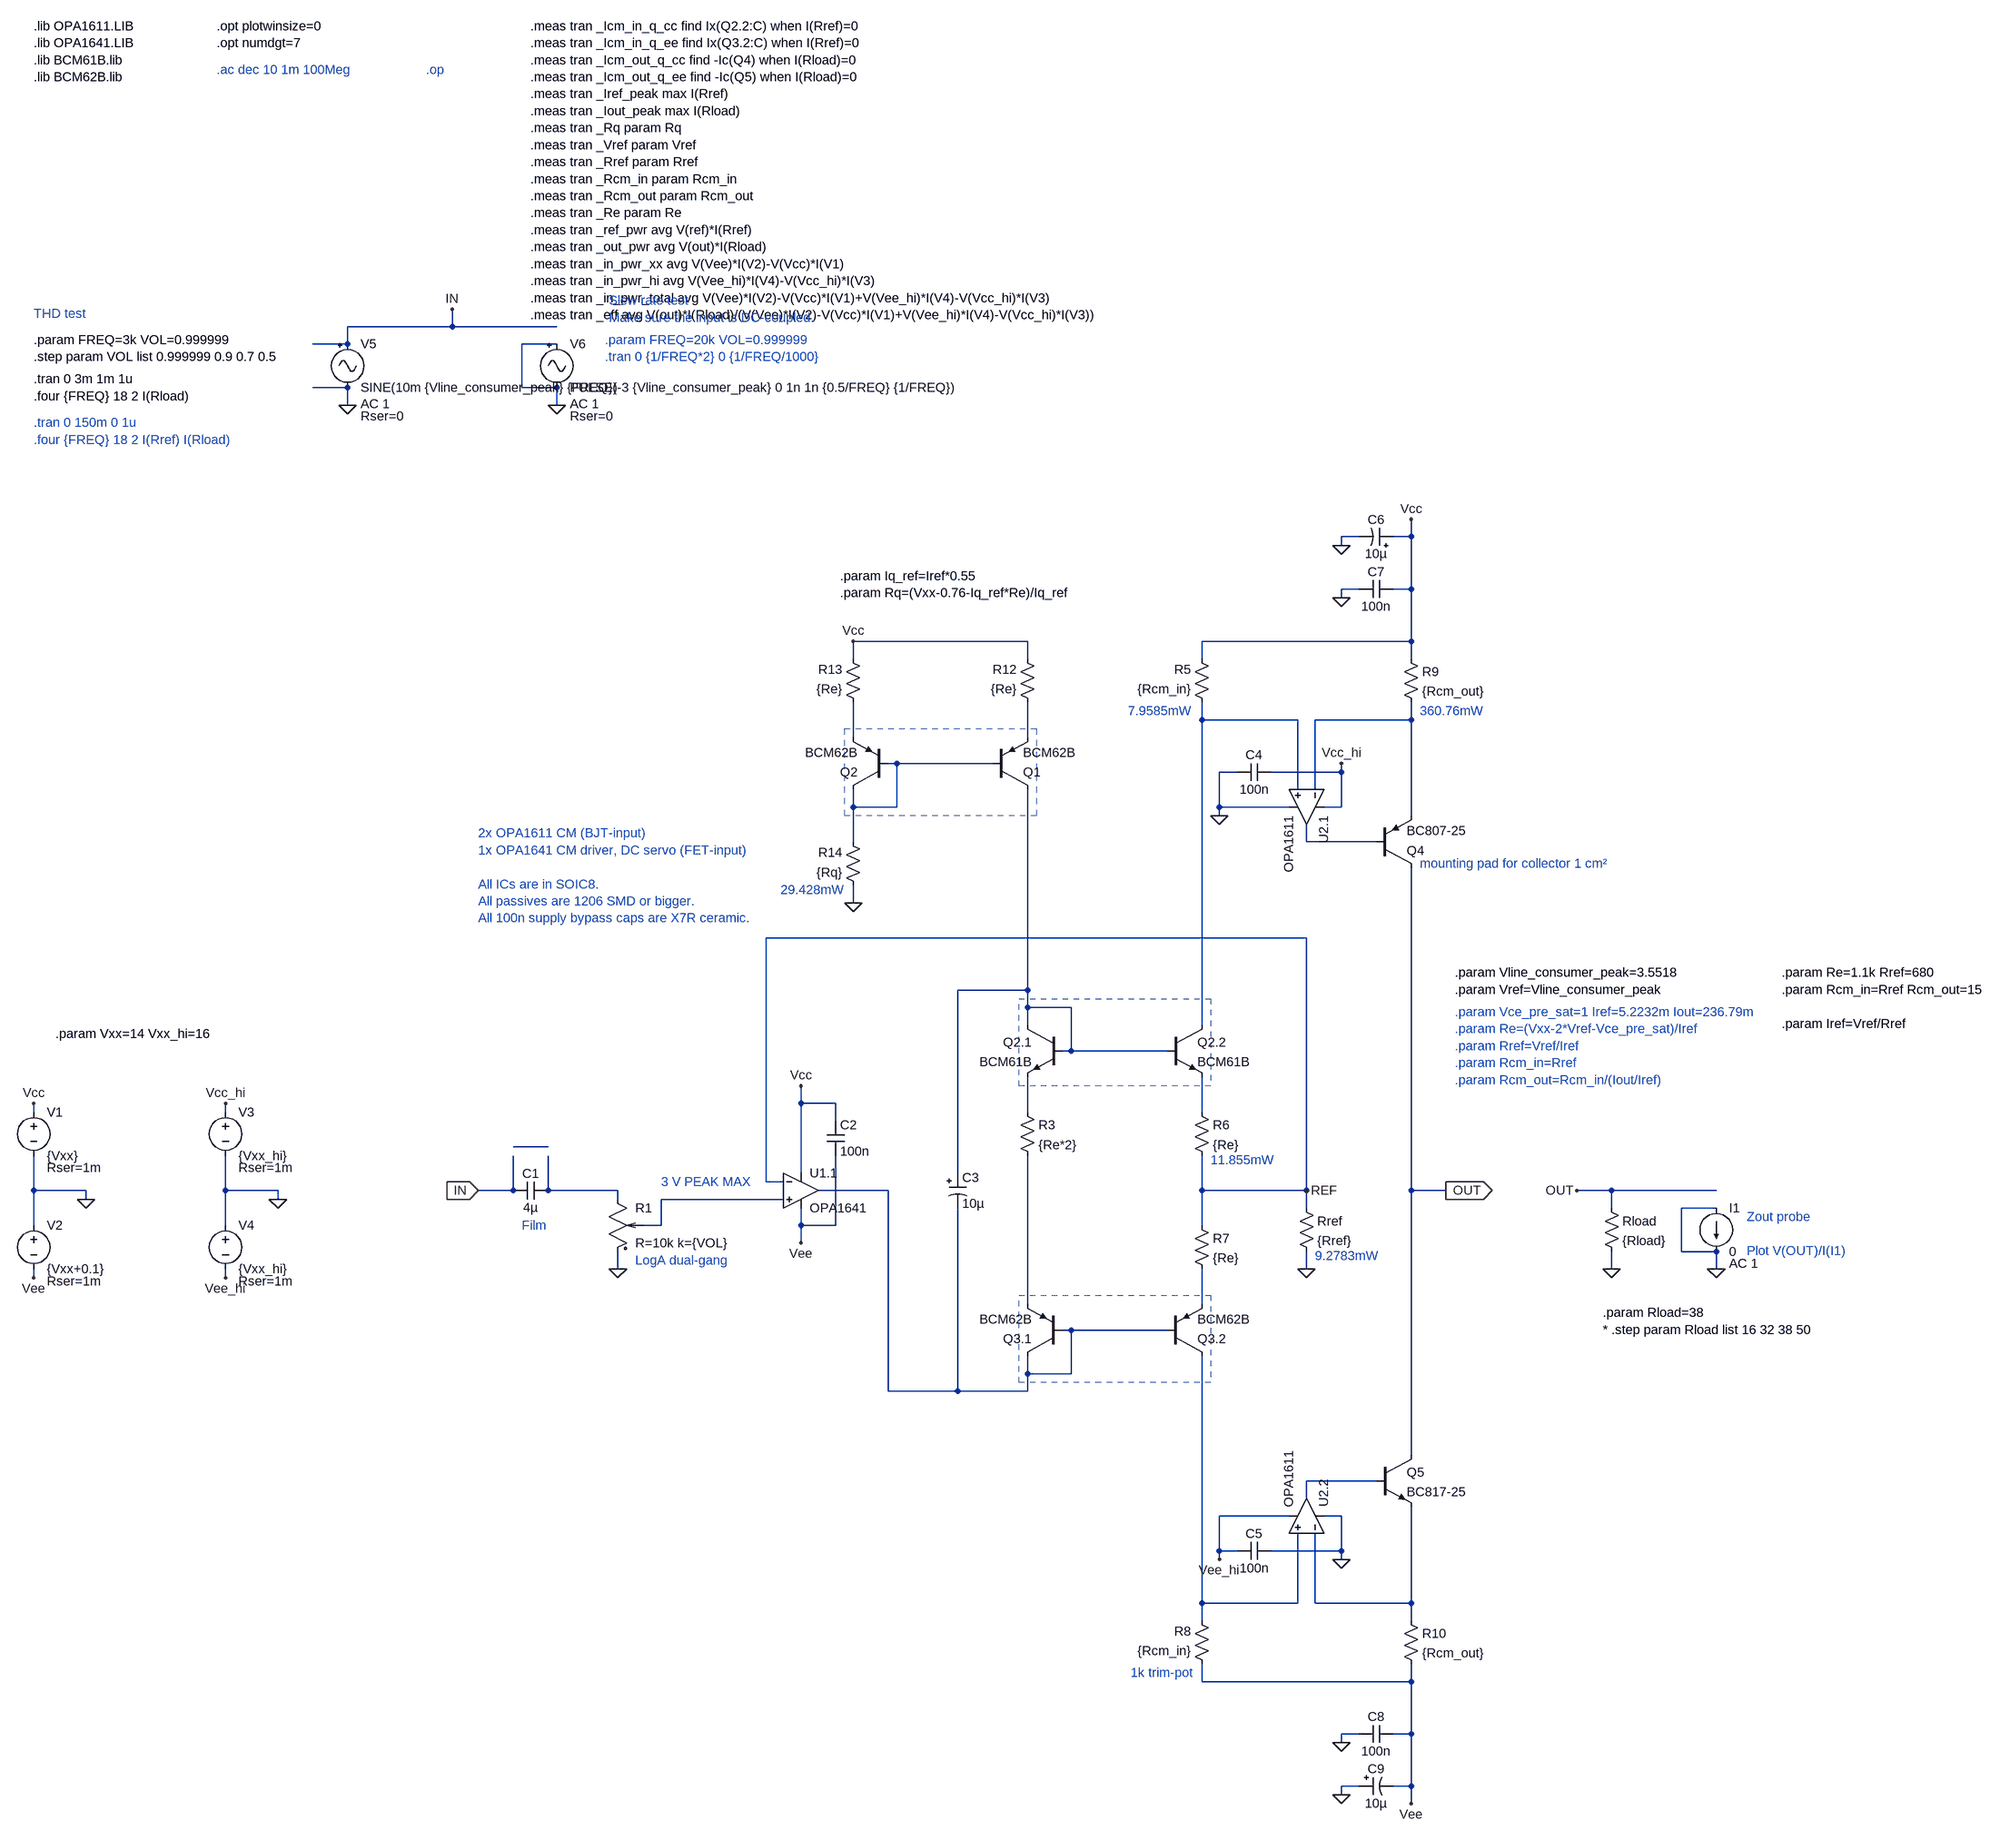
[diagram p0: schematic current-dr-amp.asc]
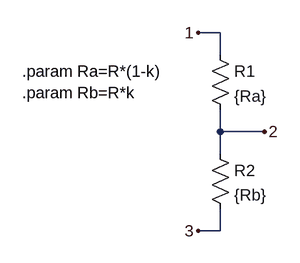
[diagram p1: sub-circuit pot_lin.asc]
current-dr-amp.asc, the LTspice schematic file:
Version 4
SHEET 1 4080 5260
WIRE 752 512 752 480
WIRE 752 512 560 512
WIRE 944 512 752 512
WIRE 560 544 560 512
WIRE 560 544 496 544
WIRE 944 544 880 544
WIRE 560 624 496 624
WIRE 880 624 880 544
WIRE 944 624 880 624
WIRE 560 656 560 624
WIRE 944 656 944 624
WIRE 2416 944 2384 944
WIRE 2512 944 2512 912
WIRE 2512 944 2480 944
WIRE 2384 960 2384 944
WIRE 2416 1040 2384 1040
WIRE 2512 1040 2512 944
WIRE 2512 1040 2480 1040
WIRE 2384 1056 2384 1040
WIRE 1808 1136 1488 1136
WIRE 2512 1136 2512 1040
WIRE 2512 1136 2128 1136
WIRE 1488 1168 1488 1136
WIRE 1808 1168 1808 1136
WIRE 2128 1168 2128 1136
WIRE 2512 1168 2512 1136
WIRE 2128 1280 2128 1248
WIRE 2304 1280 2128 1280
WIRE 2512 1280 2512 1248
WIRE 2512 1280 2336 1280
WIRE 1488 1312 1488 1248
WIRE 1808 1312 1808 1248
WIRE 1568 1360 1552 1360
WIRE 1744 1360 1568 1360
WIRE 2192 1376 2160 1376
WIRE 2384 1376 2384 1360
WIRE 2384 1376 2256 1376
WIRE 2304 1408 2304 1280
WIRE 2336 1408 2336 1280
WIRE 1488 1440 1488 1408
WIRE 1568 1440 1568 1360
WIRE 1568 1440 1488 1440
WIRE 2160 1440 2160 1376
WIRE 2288 1440 2160 1440
WIRE 2384 1440 2384 1376
WIRE 2384 1440 2352 1440
WIRE 2160 1456 2160 1440
WIRE 2512 1456 2512 1280
WIRE 1488 1504 1488 1440
WIRE 2320 1504 2320 1472
WIRE 2448 1504 2320 1504
WIRE 1488 1616 1488 1584
WIRE 2320 1680 1328 1680
WIRE 1808 1776 1808 1408
WIRE 1808 1776 1680 1776
WIRE 1808 1808 1808 1776
WIRE 1888 1808 1808 1808
WIRE 1808 1840 1808 1808
WIRE 2128 1840 2128 1280
WIRE 1888 1888 1888 1808
WIRE 1888 1888 1872 1888
WIRE 2064 1888 1888 1888
WIRE 1392 1984 1392 1952
WIRE 1456 1984 1392 1984
WIRE -16 2000 -16 1984
WIRE 336 2000 336 1984
WIRE 1808 2000 1808 1936
WIRE 2128 2000 2128 1936
WIRE 1456 2016 1456 1984
WIRE 928 2064 864 2064
WIRE 1392 2112 1392 1984
WIRE 1680 2112 1680 1776
WIRE 1328 2128 1328 1680
WIRE 1360 2128 1328 2128
WIRE -16 2144 -16 2080
WIRE 80 2144 -16 2144
WIRE 336 2144 336 2080
WIRE 432 2144 336 2144
WIRE 864 2144 864 2080
WIRE 864 2144 800 2144
WIRE 928 2144 928 2080
WIRE 1056 2144 928 2144
WIRE 1552 2144 1424 2144
WIRE 2128 2144 2128 2080
WIRE 2320 2144 2320 1680
WIRE 2320 2144 2128 2144
WIRE 2512 2144 2512 1552
WIRE 2576 2144 2512 2144
WIRE 2880 2144 2816 2144
WIRE 3072 2144 2880 2144
WIRE 80 2160 80 2144
WIRE 432 2160 432 2144
WIRE 1056 2160 1056 2144
WIRE 1360 2160 1136 2160
WIRE 2320 2176 2320 2144
WIRE 2880 2176 2880 2144
WIRE 3072 2176 3008 2176
WIRE -16 2208 -16 2144
WIRE 336 2208 336 2144
WIRE 1136 2208 1136 2160
WIRE 1136 2208 1104 2208
WIRE 1392 2208 1392 2176
WIRE 1456 2208 1456 2080
WIRE 1456 2208 1392 2208
WIRE 2128 2208 2128 2144
WIRE 1392 2240 1392 2208
WIRE 3008 2256 3008 2176
WIRE 3072 2256 3008 2256
WIRE 1056 2288 1056 2256
WIRE 2320 2288 2320 2256
WIRE 2880 2288 2880 2256
WIRE 3072 2288 3072 2256
WIRE -16 2304 -16 2288
WIRE 336 2304 336 2288
WIRE 1808 2352 1808 2080
WIRE 2128 2352 2128 2288
WIRE 1888 2400 1872 2400
WIRE 2064 2400 1888 2400
WIRE 1808 2480 1808 2448
WIRE 1888 2480 1888 2400
WIRE 1888 2480 1808 2480
WIRE 1552 2512 1552 2144
WIRE 1680 2512 1680 2176
WIRE 1680 2512 1552 2512
WIRE 1808 2512 1808 2480
WIRE 1808 2512 1680 2512
WIRE 2512 2704 2512 2144
WIRE 2448 2752 2320 2752
WIRE 2320 2784 2320 2752
WIRE 2288 2816 2160 2816
WIRE 2384 2816 2352 2816
WIRE 2160 2880 2160 2816
WIRE 2192 2880 2160 2880
WIRE 2384 2880 2384 2816
WIRE 2384 2880 2256 2880
WIRE 2160 2896 2160 2880
WIRE 2384 2896 2384 2880
WIRE 2128 2976 2128 2448
WIRE 2304 2976 2304 2848
WIRE 2304 2976 2128 2976
WIRE 2336 2976 2336 2848
WIRE 2512 2976 2512 2800
WIRE 2512 2976 2336 2976
WIRE 2128 3008 2128 2976
WIRE 2512 3008 2512 2976
WIRE 2128 3120 2128 3088
WIRE 2512 3120 2512 3088
WIRE 2512 3120 2128 3120
WIRE 2416 3216 2384 3216
WIRE 2512 3216 2512 3120
WIRE 2512 3216 2480 3216
WIRE 2384 3232 2384 3216
WIRE 2416 3312 2384 3312
WIRE 2512 3312 2512 3216
WIRE 2512 3312 2480 3312
WIRE 2384 3328 2384 3312
WIRE 2512 3344 2512 3312
FLAG 2880 2288 0
FLAG 2576 2144 OUT
IOPIN 2576 2144 Out
FLAG 3072 2288 0
FLAG 1392 1952 Vcc
FLAG 1392 2240 Vee
FLAG 2384 1360 Vcc_hi
FLAG 2160 1456 0
FLAG 2160 2896 Vee_hi
FLAG 2320 2144 REF
FLAG 2384 2896 0
FLAG 800 2144 IN
IOPIN 800 2144 In
FLAG 560 656 0
FLAG 1056 2288 0
FLAG 2512 912 Vcc
FLAG 2384 1056 0
FLAG 2384 960 0
FLAG 2512 3344 Vee
FLAG 2384 3232 0
FLAG 2384 3328 0
FLAG 2816 2144 OUT
FLAG 2320 2288 0
FLAG 944 656 0
FLAG 752 480 IN
FLAG 80 2160 0
FLAG -16 1984 Vcc
FLAG -16 2304 Vee
FLAG 432 2160 0
FLAG 336 1984 Vcc_hi
FLAG 336 2304 Vee_hi
FLAG 1488 1136 Vcc
FLAG 1488 1616 0
SYMBOL res 2864 2160 R0
SYMATTR InstName Rload
SYMATTR Value {Rload}
SYMBOL current 3072 2176 R0
WINDOW 123 24 102 Left 2
SYMATTR Value2 AC 1
SYMATTR InstName I1
SYMATTR Value 0
SYMBOL res 2304 2160 R0
SYMATTR InstName Rref
SYMATTR Value {Rref}
SYMBOL Opamps/opamp2 1392 2080 R0
SYMATTR InstName U1.1
SYMATTR Value OPA1641
SYMBOL npn 1872 1840 M0
SYMATTR InstName Q2.1
SYMATTR Value BCM61B
SYMATTR Prefix X
SYMBOL npn 2064 1840 R0
SYMATTR InstName Q2.2
SYMATTR Value BCM61B
SYMATTR Prefix X
SYMBOL pnp 2064 2448 M180
SYMATTR InstName Q3.2
SYMATTR Value BCM62B
SYMATTR Prefix X
SYMBOL pnp 1872 2448 R180
SYMATTR InstName Q3.1
SYMATTR Value BCM62B
SYMATTR Prefix X
SYMBOL res 2144 1264 R180
WINDOW 0 36 76 Left 2
WINDOW 3 36 40 Left 2
SYMATTR InstName R5
SYMATTR Value {Rcm_in}
SYMBOL res 2144 3104 R180
WINDOW 0 36 76 Left 2
WINDOW 3 36 40 Left 2
SYMATTR InstName R8
SYMATTR Value {Rcm_in}
SYMBOL res 2496 1152 R0
SYMATTR InstName R9
SYMATTR Value {Rcm_out}
SYMBOL res 2496 2992 R0
SYMATTR InstName R10
SYMATTR Value {Rcm_out}
SYMBOL npn 2448 2704 R0
SYMATTR InstName Q5
SYMATTR Value BC817-25
SYMBOL pnp 2448 1552 M180
SYMATTR InstName Q4
SYMATTR Value BC807-25
SYMBOL Opamps/opamp2 2384 1440 R90
SYMATTR InstName U2.1
SYMATTR Value OPA1611
SYMBOL Opamps/opamp2 2384 2816 M270
SYMATTR InstName U2.2
SYMATTR Value OPA1611
SYMBOL res 2112 1984 R0
SYMATTR InstName R6
SYMATTR Value {Re}
SYMBOL res 2112 2192 R0
SYMATTR InstName R7
SYMATTR Value {Re}
SYMBOL res 1792 1984 R0
SYMATTR InstName R3
SYMATTR Value {Re*2}
SYMBOL cap 928 2128 R90
WINDOW 0 0 32 VBottom 2
WINDOW 3 32 32 VTop 2
SYMATTR InstName C1
SYMATTR Value 4µ
SYMBOL Misc/signal 560 528 R0
WINDOW 123 24 126 Left 2
WINDOW 39 24 148 Left 2
SYMATTR Value2 AC 1
SYMATTR SpiceLine Rser=0
SYMATTR InstName V5
SYMATTR Value SINE(10m {Vline_consumer_peak} {FREQ})
SYMBOL pot_lin 1056 2208 R0
SYMATTR InstName R1
SYMATTR Value R=10k k={VOL}
SYMBOL cap 2416 1024 M90
WINDOW 0 0 32 VBottom 2
WINDOW 3 32 32 VTop 2
SYMATTR InstName C7
SYMATTR Value 100n
SYMBOL polcap 2480 960 M270
WINDOW 0 32 32 VTop 2
WINDOW 3 0 32 VBottom 2
SYMATTR InstName C6
SYMATTR Value 10µ
SYMBOL cap 2416 3200 M90
WINDOW 0 0 32 VBottom 2
WINDOW 3 32 32 VTop 2
SYMATTR InstName C8
SYMATTR Value 100n
SYMBOL polcap 2416 3296 M90
WINDOW 0 0 32 VBottom 2
WINDOW 3 32 32 VTop 2
SYMATTR InstName C9
SYMATTR Value 10µ
SYMBOL Misc/signal 944 528 R0
WINDOW 123 24 126 Left 2
WINDOW 39 24 148 Left 2
SYMATTR Value2 AC 1
SYMATTR SpiceLine Rser=0
SYMATTR InstName V6
SYMATTR Value PULSE(-3 {Vline_consumer_peak} 0 1n 1n {0.5/FREQ} {1/FREQ})
SYMBOL cap 2256 1360 R90
WINDOW 0 0 32 VBottom 2
WINDOW 3 32 32 VTop 2
SYMATTR InstName C4
SYMATTR Value 100n
SYMBOL cap 1440 2016 R0
SYMATTR InstName C2
SYMATTR Value 100n
SYMBOL cap 2256 2864 R90
WINDOW 0 0 32 VBottom 2
WINDOW 3 32 32 VTop 2
SYMATTR InstName C5
SYMATTR Value 100n
SYMBOL polcap 1664 2112 R0
SYMATTR InstName C3
SYMATTR Value 10µ
SYMBOL voltage -16 2192 R0
WINDOW 39 24 118 Left 2
SYMATTR SpiceLine Rser=1m
SYMATTR InstName V2
SYMATTR Value {Vxx+0.1}
SYMBOL voltage 336 2192 R0
WINDOW 39 24 118 Left 2
SYMATTR SpiceLine Rser=1m
SYMATTR InstName V4
SYMATTR Value {Vxx_hi}
SYMBOL voltage -16 1984 R0
WINDOW 39 24 118 Left 2
SYMATTR SpiceLine Rser=1m
SYMATTR InstName V1
SYMATTR Value {Vxx}
SYMBOL voltage 336 1984 R0
WINDOW 39 24 118 Left 2
SYMATTR SpiceLine Rser=1m
SYMATTR InstName V3
SYMATTR Value {Vxx_hi}
SYMBOL pnp 1744 1408 M180
SYMATTR InstName Q1
SYMATTR Value BCM62B
SYMATTR Prefix X
SYMBOL pnp 1552 1408 R180
SYMATTR InstName Q2
SYMATTR Value BCM62B
SYMATTR Prefix X
SYMBOL res 1824 1264 R180
WINDOW 0 36 76 Left 2
WINDOW 3 36 40 Left 2
SYMATTR InstName R12
SYMATTR Value {Re}
SYMBOL res 1504 1264 R180
WINDOW 0 36 76 Left 2
WINDOW 3 36 40 Left 2
SYMATTR InstName R13
SYMATTR Value {Re}
SYMBOL res 1504 1600 R180
WINDOW 0 36 76 Left 2
WINDOW 3 36 40 Left 2
SYMATTR InstName R14
SYMATTR Value {Rq}
TEXT -16 -40 Left 2 !.lib OPA1611.LIB\n.lib OPA1641.LIB\n.lib BCM61B.lib\n.lib BCM62B.lib
TEXT -16 608 Left 2 !.tran 0 3m 1m 1u\n.four {FREQ} 18 2 I(Rload)
TEXT 320 40 Left 2 ;.ac dec 10 1m 100Meg
TEXT 24 1856 Left 2 !.param Vxx=14 Vxx_hi=16
TEXT 3128 2192 Left 2 ;Zout probe\n \nPlot V(OUT)/I(I1)
TEXT -16 688 Left 2 ;.tran 0 150m 0 1u\n.four {FREQ} 18 2 I(Rref) I(Rload)
TEXT 704 40 Left 2 ;.op
TEXT 896 -40 Left 2 !.meas tran _Icm_in_q_cc find Ix(Q2.2:C) when I(Rref)=0\n.meas tran _Icm_in_q_ee find Ix(Q3.2:C) when I(Rref)=0\n.meas tran _Icm_out_q_cc find -Ic(Q4) when I(Rload)=0\n.meas tran _Icm_out_q_ee find -Ic(Q5) when I(Rload)=0\n.meas tran _Iref_peak max I(Rref)\n.meas tran _Iout_peak max I(Rload)\n.meas tran _Rq param Rq\n.meas tran _Vref param Vref\n.meas tran _Rref param Rref\n.meas tran _Rcm_in param Rcm_in\n.meas tran _Rcm_out param Rcm_out\n.meas tran _Re param Re\n.meas tran _ref_pwr avg V(ref)*I(Rref)\n.meas tran _out_pwr avg V(out)*I(Rload)\n.meas tran _in_pwr_xx avg V(Vee)*I(V2)-V(Vcc)*I(V1)\n.meas tran _in_pwr_hi avg V(Vee_hi)*I(V4)-V(Vcc_hi)*I(V3)\n.meas tran _in_pwr_total avg V(Vee)*I(V2)-V(Vcc)*I(V1)+V(Vee_hi)*I(V4)-V(Vcc_hi)*I(V3)\n.meas tran _eff avg V(out)*I(Rload)/(V(Vee)*I(V2)-V(Vcc)*I(V1)+V(Vee_hi)*I(V4)-V(Vcc_hi)*I(V3))
TEXT 2864 2368 Left 2 !.param Rload=38\n* .step param Rload list 16 32 38 50
TEXT 1136 2128 Left 2 ;3 V PEAK MAX
TEXT 880 2208 Left 2 ;Film
TEXT 800 1488 Left 2 ;2x OPA1611 CM (BJT-input)\n1x OPA1641 CM driver, DC servo (FET-input)\n \nAll ICs are in SOIC8.\nAll passives are 1206 SMD or bigger.\nAll 100n supply bypass caps are X7R ceramic.
TEXT 1088 2272 Left 2 ;LogA dual-gang
TEXT 2592 1816 Left 2 ;.param Vce_pre_sat=1 Iref=5.2232m Iout=236.79m\n.param Re=(Vxx-2*Vref-Vce_pre_sat)/Iref\n.param Rref=Vref/Iref\n.param Rcm_in=Rref\n.param Rcm_out=Rcm_in/(Iout/Iref)
TEXT -16 536 Left 2 !.param FREQ=3k VOL=0.999999\n.step param VOL list 0.999999 0.9 0.7 0.5
TEXT 1032 536 Left 2 ;.param FREQ=20k VOL=0.999999\n.tran 0 {1/FREQ*2} 0 {1/FREQ/1000}
TEXT 320 -40 Left 2 !.opt plotwinsize=0\n.opt numdgt=7
TEXT 2112 3104 Right 2 ;1k trim-pot
TEXT 2528 1264 Left 2 ;360.76mW
TEXT 1992 1264 Left 2 ;7.9585mW
TEXT 2144 2088 Left 2 ;11.855mW
TEXT 2336 2264 Left 2 ;9.2783mW
TEXT 2528 1544 Left 2 ;mounting pad for collector 1 cm²
TEXT 1040 464 Left 2 ;Slew rate test\nMake sure the input is DC-coupled.
TEXT -16 488 Left 2 ;THD test
TEXT 1464 1016 Left 2 !.param Iq_ref=Iref*0.55\n.param Rq=(Vxx-0.76-Iq_ref*Re)/Iq_ref
TEXT 3192 1744 Left 2 !.param Re=1.1k Rref=680\n.param Rcm_in=Rref Rcm_out=15\n \n.param Iref=Vref/Rref
TEXT 2592 1744 Left 2 !.param Vline_consumer_peak=3.5518\n.param Vref=Vline_consumer_peak
TEXT 1472 1592 Right 2 ;29.428mW
RECTANGLE Normal 1792 2336 2144 2496 2
RECTANGLE Normal 1792 1792 2144 1952 2
RECTANGLE Normal 1472 1296 1824 1456 2

pot_lin.asc, the sub-circuit schematic file:
Version 4
SHEET 1 880 680
WIRE 336 160 304 160
WIRE 336 192 336 160
WIRE 336 304 336 272
WIRE 400 304 336 304
WIRE 336 336 336 304
WIRE 336 448 336 416
WIRE 336 448 304 448
FLAG 304 160 1
FLAG 400 304 2
FLAG 304 448 3
SYMBOL res 320 176 R0
SYMATTR InstName R1
SYMATTR Value {Ra}
SYMBOL res 320 320 R0
SYMATTR InstName R2
SYMATTR Value {Rb}
TEXT 48 216 Left 2 !.param Ra=R*(1-k)\n.param Rb=R*k

The netlist it stands for:
* current-dr-amp.asc
Rload OUT 0 {Rload}
I1 0 0 0 AC 1
Rref REF 0 {Rref}
XU1.1 N013 REF Vcc Vee N012 OPA1641  ; pins In+ In- V+ V- OUT
XQ2.1 N007 N007 N008 BCM61B  ; pins C B E
XQ2.2 N001 N007 N009 BCM61B  ; pins C B E
XQ3.2 N017 N012 N015 BCM62B  ; pins C B E
XQ3.1 N012 N012 N014 BCM62B  ; pins C B E
R5 N001 Vcc {Rcm_in}
R8 Vee N017 {Rcm_in}
R9 Vcc N002 {Rcm_out}
R10 N018 Vee {Rcm_out}
Q5 OUT N016 N018 0 BC817-25
Q4 OUT N006 N002 0 BC807-25
XU2.1 N001 N002 Vcc_hi 0 N006 OPA1611  ; pins In+ In- V+ V- OUT
XU2.2 N017 N018 0 Vee_hi N016 OPA1611  ; pins In+ In- V+ V- OUT
R6 N009 REF {Re}
R7 REF N015 {Re}
R3 N008 N014 {Re*2}
C1 N011 IN 4µ
V5 IN 0 SINE(10m {Vline_consumer_peak} {FREQ}) AC 1 Rser=0
XR1 N011 N013 0 pot_lin params: R=10k k={VOL}
C7 0 Vcc 100n
C6 Vcc 0 10µ
C8 0 Vee 100n
C9 0 Vee 10µ
V6 0 0 PULSE(-3 {Vline_consumer_peak} 0 1n 1n {0.5/FREQ} {1/FREQ}) AC 1 Rser=0
C4 Vcc_hi 0 100n
C2 Vcc Vee 100n
C5 0 Vee_hi 100n
C3 N007 N012 10µ
V2 0 Vee {Vxx+0.1} Rser=1m
V4 0 Vee_hi {Vxx_hi} Rser=1m
V1 Vcc 0 {Vxx} Rser=1m
V3 Vcc_hi 0 {Vxx_hi} Rser=1m
XQ1 N007 N005 N004 BCM62B  ; pins C B E
XQ2 N005 N005 N003 BCM62B  ; pins C B E
R12 N004 Vcc {Re}
R13 N003 Vcc {Re}
R14 0 N005 {Rq}

* block symbol definitions
.subckt pot_lin 1 2 3
R1 1 2 {Ra}
R2 2 3 {Rb}
.param Ra=R*(1-k)
.param Rb=R*k
.ends pot_lin

.model NPN NPN
.model PNP PNP
.lib standard.bjt
.lib OPA1611.LIB
.lib OPA1641.LIB
.lib BCM61B.lib
.lib BCM62B.lib
.tran 0 3m 1m 1u
.four {FREQ} 18 2 I(Rload)
* .ac dec 10 1m 100Meg
.param Vxx=14 Vxx_hi=16
* Zout probe
* Plot V(OUT)/I(I1)
* .tran 0 150m 0 1u
* .four {FREQ} 18 2 I(Rref) I(Rload)
* .op
.meas tran _Icm_in_q_cc find Ix(Q2.2:C) when I(Rref)=0
.meas tran _Icm_in_q_ee find Ix(Q3.2:C) when I(Rref)=0
.meas tran _Icm_out_q_cc find -Ic(Q4) when I(Rload)=0
.meas tran _Icm_out_q_ee find -Ic(Q5) when I(Rload)=0
.meas tran _Iref_peak max I(Rref)
.meas tran _Iout_peak max I(Rload)
.meas tran _Rq param Rq
.meas tran _Vref param Vref
.meas tran _Rref param Rref
.meas tran _Rcm_in param Rcm_in
.meas tran _Rcm_out param Rcm_out
.meas tran _Re param Re
.meas tran _ref_pwr avg V(ref)*I(Rref)
.meas tran _out_pwr avg V(out)*I(Rload)
.meas tran _in_pwr_xx avg V(Vee)*I(V2)-V(Vcc)*I(V1)
.meas tran _in_pwr_hi avg V(Vee_hi)*I(V4)-V(Vcc_hi)*I(V3)
.meas tran _in_pwr_total avg V(Vee)*I(V2)-V(Vcc)*I(V1)+V(Vee_hi)*I(V4)-V(Vcc_hi)*I(V3)
.meas tran _eff avg V(out)*I(Rload)/(V(Vee)*I(V2)-V(Vcc)*I(V1)+V(Vee_hi)*I(V4)-V(Vcc_hi)*I(V3))
.param Rload=38
* .step param Rload list 16 32 38 50
* 3 V PEAK MAX
* Film
* 2x OPA1611 CM (BJT-input)
* 1x OPA1641 CM driver, DC servo (FET-input)
* All ICs are in SOIC8.
* All passives are 1206 SMD or bigger.
* All 100n supply bypass caps are X7R ceramic.
* LogA dual-gang
* .param Vce_pre_sat=1 Iref=5.2232m Iout=236.79m
* .param Re=(Vxx-2*Vref-Vce_pre_sat)/Iref
* .param Rref=Vref/Iref
* .param Rcm_in=Rref
* .param Rcm_out=Rcm_in/(Iout/Iref)
.param FREQ=3k VOL=0.999999
.step param VOL list 0.999999 0.9 0.7 0.5
* .param FREQ=20k VOL=0.999999
* .tran 0 {1/FREQ*2} 0 {1/FREQ/1000}
.opt plotwinsize=0
.opt numdgt=7
* 1k trim-pot
* 360.76mW
* 7.9585mW
* 11.855mW
* 9.2783mW
* mounting pad for collector 1 cm²
* Slew rate test
* Make sure the input is DC-coupled.
* THD test
.param Iq_ref=Iref*0.55
.param Rq=(Vxx-0.76-Iq_ref*Re)/Iq_ref
.param Re=1.1k Rref=680
.param Rcm_in=Rref Rcm_out=15
.param Iref=Vref/Rref
.param Vline_consumer_peak=3.5518
.param Vref=Vline_consumer_peak
* 29.428mW
.backanno
.end